# Altium schematic sheet PMP9755.SchDoc
size A4; Date: Not shown in title block; ApprovedBy: Not shown in title block; CheckedBy: Not shown in title block; Author: Not shown in title block; CompanyName: Not shown in title block; Engineer: Not shown in title block; Organization: Not shown in title block; Address1: Not shown in title block; Address2: Not shown in title block; Address3: Not shown in title block; Address4: Not shown in title block; DocumentNumber: 1; Revision: Use project parameter SCH_Rev; SheetNumber: 1; SheetTotal: 1; PageSetup: Record=PageOptions|CenterHorizontal=True|CenterVertical=True|PrintScale=0.91|XCorrection=1.00|YCorrection=1.00|PrintKind=0|BorderSize=5000000|LeftOffset=0|BottomOffset=0|Orientation=2|PaperLength=1000|PaperWidth=1000|Scale=100|PaperSource=15|PrintQuality=600|MediaType=1|DitherType=10|PaperKind=Letter|PrintScaleMode=1; CurrentTime: Not shown in title block; CurrentDate: Not shown in title block; Time: Not shown in title block; DocumentFullPathAndName: Not shown in title block; DocumentName: Not shown in title block; ModifiedDate: Not shown in title block; ImagePath: Not shown in title block
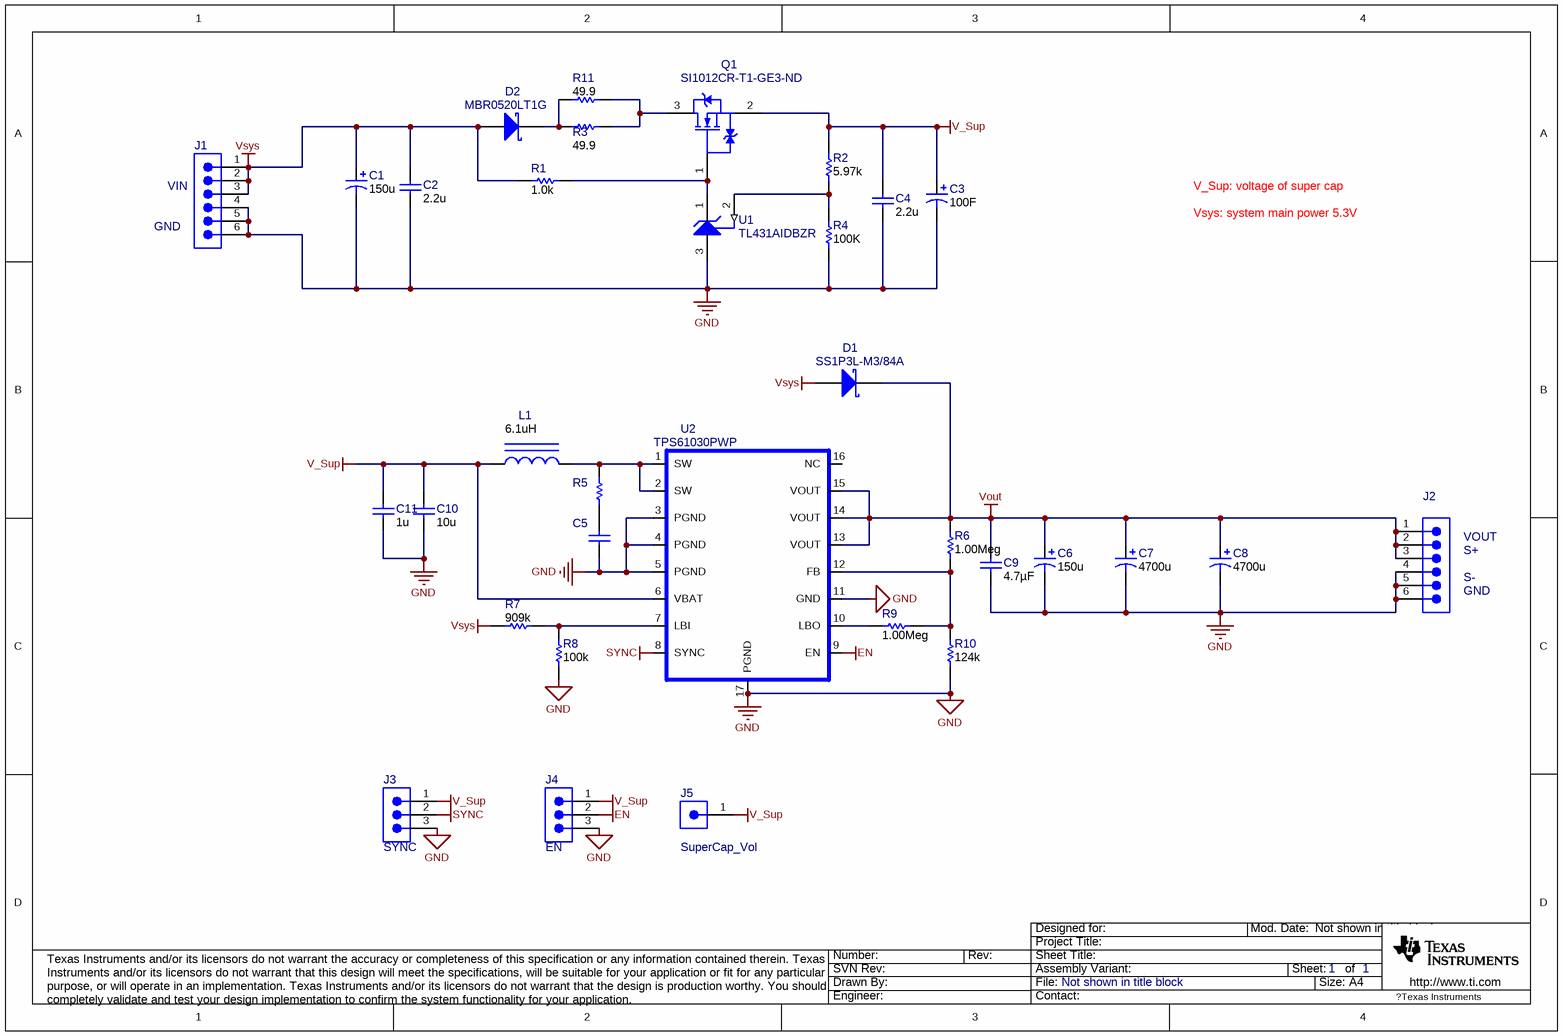
[diagram p0: PMP9755.SchDoc]

## Parts
C1  ValueDisplayed: 150u  [3528-21]  (hidden comment: T520B157M006ATE070)
C2  ValueDisplayed: 2.2u  [0603]  (hidden comment: GRM188R61A225KE34D)
C3  ValueDisplayed: 100F  [HV_2500x5000]  (hidden comment: HVZ0E107NF-LT)
C4  ValueDisplayed: 2.2u  [0603]  (hidden comment: GRM188R60J225KE19D)
C5  GRM1885C1H101JA01D  [0603]  (value not drawn)
C6  ValueDisplayed: 150u  [3528-21]  (hidden comment: T520B157M006ATE070)
C7  ValueDisplayed: 4700u  [FR_1250x2500]  (hidden comment: EEUFR0J472)
C8  ValueDisplayed: 4700u  [FR_1250x2500]  (hidden comment: EEUFR0J472)
C9  ValueDisplayed: 4.7µF  [0603]  (hidden comment: GRM188R61C475KAAJ)
C10  ValueDisplayed: 10u  [0603]  (hidden comment: GRM188R61A106ME69)
C11  ValueDisplayed: 1u  [0603]  (hidden comment: GRM185R60J105KE26D)
D1  SS1P3L-M3/84A  [DO-220AA]
D2  MBR0520LT1G  [SOD-123]
J1  TSW-106-07-G-S  [TSW-106-07-G-S]  (value not drawn)
J2  TSW-106-07-G-S  [TSW-106-07-G-S]  (value not drawn)
J3  TSW-103-07-G-S  [TSW-103-07-G-S]  (value not drawn)
J4  TSW-103-07-G-S  [TSW-103-07-G-S]  (value not drawn)
J5  TSW-101-17-T-S  [Samtec_TSW-101-17-T-S]  (value not drawn)
L1  value 6.1uH  [cdrh127]  (hidden comment: CDRH127NP-6R1NC)
Q1  SI1012CR-T1-GE3-ND  [SOT-416]
R1  value 1.0k  [0603]  (hidden comment: CRCW06031K00JNEA)
R2  value 5.97k  [0603]  (hidden comment: RT0603BRD075K97L)
R3  value 49.9  [2512]  (hidden comment: CRCW251249R9FKEG)
R4  value 100K  [0603]  (hidden comment: RT0603DRE07100KL)
R5  CRCW0603100RJNEA  [0603]  (value not drawn)
R6  value 1.00Meg  [0603]  (hidden comment: RC0603FR-071ML)
R7  value 909k  [0603]  (hidden comment: RC0603FR-07909KL)
R8  value 100k  [0603]  (hidden comment: RT0603DRE07100KL)
R9  value 1.00Meg  [0603]  (hidden comment: RC0603FR-071ML)
R10  value 124k  [0603]  (hidden comment: CRCW0603124KFKEA)
R11  value 49.9  [2512]  (hidden comment: CRCW251249R9FKEG)
U1  TL431AIDBZR  [DBZ0003A_N]
U2  TPS61030PWP  [PWP16]

## Nets
EN: J4.2 U2.9(EN)
GND: C1.2(-) C2.2 C3.2(-) C4.2 C5.2 C6.2(-) C7.2(-) C8.2(-) C9.2 C10.2 C11.2 J1.4 J1.5 J1.6 J2.4 J2.5 J2.6 J3.3 J4.3 R4.2 R8.1 R10.1 U1.3(ANODE) U2.3(PGND) U2.4(PGND) U2.5(PGND) U2.11(GND) U2.17(PGND)
SYNC: J3.2 U2.8(SYNC)
V_Sup: C3.1(+) C4.1 C10.1 C11.1 J3.1 J4.1 J5.1 L1.1 Q1.2(S) R2.2 U2.6(VBAT)
Vout: C6.1(+) C7.1(+) C8.1(+) C9.1 D1.1(K) J2.1 J2.2 J2.3 R6.2 U2.13(VOUT) U2.14(VOUT) U2.15(VOUT)
Vsys: C1.1(+) C2.1 D1.2(A) D2.2(A) J1.1 J1.2 J1.3 R1.1 R7.1
NetC5_1: C5.1 R5.1
NetD2_1: D2.1(K) R3.1 R11.1
NetL1_2: L1.2 R5.2 U2.1(SW) U2.2(SW)
NetQ1_1: Q1.1(G) R1.2 U1.1(CATHODE)
NetQ1_3: Q1.3(D) R3.2 R11.2
NetR2_1: R2.1 R4.1 U1.2(REF)
NetR6_1: R6.1 R9.1 R10.2 U2.12(FB)
NetR7_2: R7.2 R8.2 U2.7(LBI)
NetR9_2: R9.2 U2.10(LBO)

Not connected (* = marked no-connect by the designer): U2 16(NC)

## Notes on the sheet
- (near J1) GND
- (near J1) VIN
- V_Sup: voltage of super cap
- Vsys: system main power 5.3V
- (near J2) VOUT
- (near J2) S+
- (near J2) S-
- (near J2) GND
- (near J3) SYNC
- (near J4) EN
- (near J5) SuperCap_Vol
- Drawn By:
- SVN Rev:
- Number:
- Rev:
- Sheet Title:
- File:
- Project Title:
- Designed for:
- Assembly Variant:
- Mod. Date:
- Sheet:
- Size:
- of
- A4
- http://www.ti.com
- Texas Instruments and/or its licensors do not warrant the accuracy or completeness of this specification or any information contained therein. Texas Instruments and/or its licensors do not warrant that this design will meet the specifications, will be suitable for your application or fit for any particular purpose, or will operate in an implementation. Texas Instruments and/or its licensors do not warrant that the design is production worthy. You should completely validate and test your design implementation to confirm the system functionality for your application.
- Engineer:
- Contact:
- ?Texas Instruments

## Library data of the parts
C1 C6 = T520B157M006ATE070: CAP, TA, 150uF, 6.3V, +/-20%, 0.07 ohm, SMD; Manufacturer: Kemet; Polarized: Y; CompType: Capacitor; U/M: EA; Cap_F: 0.00015; Tolerance_%: 20; VDC_V: 6.3; ESR_Ohm: 0.07; IRMS_A: 1.3; TaMin_C: -55; TaMax_C: 105; Cap_Case: B; SymbolVersion: 2008-07-09; Value: 150uF; PartNumber: T520B157M006ATE070; PackageReference: 3528-21; RoHS: Y; Value1: 0.07 ohm; Value2: 6.3V; MountType: SMT; Technology: TA; Series: T520; Publisher: Texas Instruments; LatestRevisionDate: 2014-03-08; LatestRevisionNote: Updated supplier links; ComponentLink1Description: Datasheet link; ComponentLink1URL: http://www.kemet.com/kemet/web/homepage/kechome.nsf/file/T520%20Series/$file/KEM_T2015_T520.pdf; Supplier 1: Digi-Key; Supplier Part Number 1: 399-4732-1-ND; Supplier 2: Mouser; Supplier Part Number 2: 80-T520B157M6ATE70; Supplier 3: Newark; Supplier Part Number 3: 43K4377
C2 = GRM188R61A225KE34D: CAP, CERM, 2.2uF, 10V, +/-10%, X5R, 0603; Manufacturer: MuRata; Polarized: N; CompType: Capacitor; U/M: EA; Cap_F: 0.0000022; Tolerance_%: 10; Value1: Unknown; TaMin_C: -55; TaMax_C: 85; SymbolVersion: 2008-07-09; Value: 2.2uF; PartNumber: GRM188R61A225KE34D; PackageReference: 0603; RoHS: Y; VDC_V: 10; Value2: 10V; MountType: SMT; Technology: Ceramic; TempCo: X5R; Cap_Case: 0603; Published: 2008-06-19; Publisher: Texas Instruments; LatestRevisionDate: 2014-05-15; ComponentLink1Description: Datasheet link; ComponentLink1URL: http://search.murata.co.jp/Ceramy/PnsearchViewAction.do?HnOFG=ON&HnNFG=ON&SEL_CNT=50&sLang=en&sKey=GRM188R61A225KE34D&x=9&y=9&search=startwith; Supplier 1: Digi-Key; Supplier Part Number 1: 490-1545-1-ND; Supplier 2: Mouser; Supplier Part Number 2: 81-GRM188R61A225KE34; Supplier 3: Farnell; Supplier Part Number 3: 1828799
C3 = HVZ0E107NF-LT: CAP, Electric Double Layer, 100 F, 2.7 V, +30/-50%, 0.03 ohm, TH; Manufacturer: Kemet; Polarized: Y; CompType: Capacitor; Value: 100000000uF; U/M: EA; Cap_F: 100; Tolerance_%: 30; VDC_V: 2.7; Value2: 2.7V; ESR_ohm: 0.03; IRMS_A: 4; TaMin_C: -25; TaMax_C: 60; Cap_Case: 25x50; SymbolVersion: 2008-07-09; PartNumber: HVZ0E107NF-LT; PackageReference: 25x50mm; RoHS: Y; Value1: 0.03 ohm; MountType: TH; Technology: Electric Double Layer; Series: HV; Publisher: Texas Instruments; LatestRevisionDate: 2014-08-07; ComponentLink1Description: Datasheet link; ComponentLink1URL: http://capacitoredge.kemet.com/capedge2/DataSheet/Datasheet-HVZ0E107NF_LT.pdf?pn=HVZ0E107NF-LT{KEM}
C4 = GRM188R60J225KE19D: CAP, CERM, 2.2uF, 6.3V, +/-10%, X5R, 0603; Manufacturer: MuRata; Polarized: N; CompType: Capacitor; U/M: EA; Cap_F: 0.0000022; Tolerance_%: 10; Value1: Unknown; VDC_V: 6.3; TaMin_C: -55; TaMax_C: 85; SymbolVersion: 2008-07-09; Value: 2.2uF; PartNumber: GRM188R60J225KE19D; PackageReference: 0603; RoHS: Y; Value2: 6.3V; MountType: SMT; Technology: Ceramic; TempCo: X5R; Cap_Case: 0603; Published: 2008-06-19; Publisher: Texas Instruments; LatestRevisionDate: 2014-05-15; ComponentLink1Description: Datasheet link; ComponentLink1URL: http://search.murata.co.jp/Ceramy/PnsearchViewAction.do?HnOFG=ON&HnNFG=ON&SEL_CNT=50&sLang=en&sKey=GRM188R60J225KE19D&x=9&y=9&search=startwith; Supplier 1: Mouser; Supplier Part Number 1: 81-GRM18R60J225KE19D
C5 = GRM1885C1H101JA01D: CAP, CERM, 100pF, 50V, +/-5%, C0G/NP0, 0603; Manufacturer: MuRata; Polarized: N; CompType: Capacitor; U/M: EA; Cap_F: 0.0000000001; Tolerance_%: 5; Value1: Unknown; VDC_V: 50; TaMin_C: -55; TaMax_C: 125; SymbolVersion: 2008-07-09; Value: 100pF; PartNumber: GRM1885C1H101JA01D; ValueDisplayed: 100pF; PackageReference: 0603; RoHS: Y; Value2: 50V; MountType: SMT; Technology: Ceramic; TempCo: C0G/NP0; Cap_Case: 0603; Published: 2008-06-19; Publisher: Texas Instruments; LatestRevisionDate: 2014-05-15; ComponentLink1Description: Datasheet link; ComponentLink1URL: http://search.murata.co.jp/Ceramy/PnsearchViewAction.do?HnOFG=ON&HnNFG=ON&SEL_CNT=50&sLang=en&sKey=GRM1885C1H101JA01D&x=9&y=9&search=startwith; Supplier 1: Digi-Key; Supplier Part Number 1: 490-1427-1-ND; Supplier 2: Mouser; Supplier Part Number 2: 81-GRM39C101J50; Supplier 3: Farnell; Supplier Part Number 3: 8819866
C7 C8 = EEUFR0J472: CAP, AL, 4700uF, 6.3V, +/-20%, 0.015 ohm, TH; Manufacturer: Panasonic; Polarized: Y; CompType: Capacitor; U/M: EA; Cap_F: 0.0047; Tolerance_%: 20; VDC_V: 6.3; ESR_Ohm: 0.015; IRMS_A: 3.19; TaMin_C: -40; TaMax_C: 105; Cap_Case: 12.5x25; SymbolVersion: 2008-07-09; Value: 4700uF; PartNumber: EEUFR0J472; PackageReference: 12.5x25mm; RoHS: Y; Value1: 0.015 ohm; Value2: 6.3V; MountType: TH; Technology: AL; Series: FR; Publisher: Texas Instruments; LatestRevisionDate: 2014-05-19; ComponentLink1Description: Datasheet link; ComponentLink1URL: http://industrial.panasonic.com/www-data/pdf/ABA0000/ABA0000CE132.pdf; Supplier 1: Digi-Key; Supplier Part Number 1: P14368-ND; Supplier 2: Mouser; Supplier Part Number 2: 667-EEU-FR0J472; Supplier 3: Farnell; Supplier Part Number 3: 1800613
C9 = GRM188R61C475KAAJ: CAP, CERM, 4.7 µF, 16 V, +/- 10%, X5R, 0603; Manufacturer: MuRata; Polarized: N; CompType: Capacitor; Value: 4.7uF; U/M: EA; Cap_F: 0.0000047; Tolerance_%: 10; Value1: Unknown; VDC_V: 16; Value2: 16V; TaMin_C: -55; TaMax_C: 85; SymbolVersion: 2008-07-09; PartNumber: GRM188R61C475KAAJ; PackageReference: 0603; RoHS: Y; MountType: SMT; Technology: Ceramic; TempCo: X5R; Cap_Case: 0603; Published: 2008-06-19; Publisher: Texas Instruments; LatestRevisionDate: 2014-07-21; ComponentLink1Description: Datasheet link; ComponentLink1URL: http://psearch.murata.com/capacitor/product/GRM188R61C475KAAJ%23.pdf
C10 = GRM188R61A106ME69: CAP, CERM, 10uF, 10V, +/-20%, X5R, 0603; Manufacturer: MuRata; Polarized: N; CompType: Capacitor; U/M: EA; Cap_F: 0.00001; Tolerance_%: 20; Value1: Unknown; VDC_V: 10; TaMin_C: -55; TaMax_C: 85; SymbolVersion: 2008-07-09; Value: 10uF; PartNumber: GRM188R61A106ME69; PackageReference: 0603; RoHS: Y; Value2: 10V; MountType: SMT; Technology: Ceramic; TempCo: X5R; Cap_Case: 0603; Published: 2008-06-19; Publisher: Texas Instruments; LatestRevisionDate: 2014-05-15; ComponentLink1Description: Datasheet link; ComponentLink1URL: http://psearch.murata.com/capacitor/product/GRM188R61A106ME69%23.pdf
C11 = GRM185R60J105KE26D: CAP, CERM, 1uF, 6.3V, +/-10%, X5R, 0603; Manufacturer: MuRata; Polarized: N; CompType: Capacitor; U/M: EA; Cap_F: 0.000001; Tolerance_%: 10; Value1: Unknown; VDC_V: 6.3; TaMin_C: -55; TaMax_C: 85; SymbolVersion: 2008-07-09; Value: 1uF; PartNumber: GRM185R60J105KE26D; PackageReference: 0603; RoHS: Y; Value2: 6.3V; MountType: SMT; Technology: Ceramic; TempCo: X5R; Cap_Case: 0603; Published: 2008-06-19; Publisher: Texas Instruments; LatestRevisionDate: 2014-05-15; ComponentLink1Description: Datasheet link; ComponentLink1URL: http://search.murata.co.jp/Ceramy/PnsearchViewAction.do?HnOFG=ON&HnNFG=ON&SEL_CNT=50&sLang=en&sKey=GRM185R60J105KE26D&x=9&y=9&search=startwith; Supplier 1: Mouser; Supplier Part Number 1: 81-GRM185R60J105KE26
D1 = SS1P3L-M3/84A: Diode, Schottky, 30V, 1.5A, DO-220AA; Manufacturer: Vishay-Semiconductor; U/M: EA; Vf_V: 0.45; Value2: 0.45V; Io_A: 1.5; Vr_V: 30; TJmax_C: 150; RJC_CperW: 20; CompType: Diode; SymbolVersion: 2008-12-08; PartNumber: SS1P3L-M3/84A; PackageReference: DO-220AA; Value: 30V; Value1: 1.5A; MountType: SMT; Type: Schottky; RoHS: Y; Published: 2008-06-26; Publisher: Texas Instruments; LatestRevisionDate: 2014-04-09; ComponentLink1Description: Datasheet link; ComponentLink1URL: http://www.vishay.com/docs/88915/ss1p3l.pdf; Supplier 1: Digi-Key; Supplier Part Number 1: SS1P3L-M3/84AGICT-ND; Supplier 2: Mouser; Supplier Part Number 2: 625-SS1P3L-M3/84A; Supplier 3: Newark; Supplier Part Number 3: 79R2711
D2 = MBR0520LT1G: Diode, Schottky, 20V, 0.5A, SOD-123; Manufacturer: ON Semiconductor; U/M: EA; Vf_V: 0.385; Value2: 0.385V; Io_A: 0.5; Vr_V: 20; TJmax_C: 125; RJC_CperW: 150; CompType: Diode; SymbolVersion: 2008-12-08; PartNumber: MBR0520LT1G; PackageReference: SOD-123; Value: 20V; Value1: 0.5A; MountType: SMT; Type: Schottky; RoHS: Y; Published: 2008-06-26; Publisher: Texas Instruments; LatestRevisionDate: 2014-07-01; ComponentLink1Description: Datasheet link; ComponentLink1URL: http://www.onsemi.com/pub_link/Collateral/MBR0520LT1-D.PDF; Supplier 1: Digi-Key; Supplier Part Number 1: MBR0520LT1GOSCT-ND; Supplier 2: Mouser; Supplier Part Number 2: 863-MBR0520LT1G; Supplier 3: Farnell; Supplier Part Number 3: 9556915
J1 J2 = TSW-106-07-G-S: Header, TH, 100mil, 6x1, Gold plated, 230 mil above insulator; Manufacturer: Samtec, Inc.; Alternate Manufacturer: Any; Alternate PartNumber: Equivalent; U/M: EA; PartNumber: TSW-106-07-G-S; ClassName: Header; CompType: Header; RoHS: Y; PackageReference: TSW-106-07-G-S; MountType: TH; ComponentLink1Description: Datasheet Link; ComponentLink1URL: http://samtec.com/ftppub/pdf/TSW_TH.PDF; Publisher: Texas Instruments; LatestRevisionDate: 2012-11-04; LatestRevisionNote: Added parts, moved some to Hardware.IntLib; Supplier 1: Digi-Key; Supplier Part Number 1: SAM1029-06-ND
J3 J4 = TSW-103-07-G-S: Header, TH, 100mil, 3x1, Gold plated, 230 mil above insulator; Manufacturer: Samtec, Inc.; Alternate Manufacturer: Any; Alternate PartNumber: Equivalent; U/M: EA; PartNumber: TSW-103-07-G-S; ClassName: Header; CompType: Header; RoHS: Y; PackageReference: TSW-103-07-G-S; MountType: TH; ComponentLink1Description: Datasheet Link; ComponentLink1URL: http://samtec.com/ftppub/pdf/TSW_TH.PDF; Publisher: Texas Instruments; LatestRevisionDate: 2012-11-04; LatestRevisionNote: Added parts, moved some to Hardware.IntLib; Supplier 1: Digi-Key; Supplier Part Number 1: SAM1029-03-ND
J5 = TSW-101-17-T-S: CONN HEADER 1POS .100" SNGL TIN, TH; Manufacturer: Samtec; SymbolCreator: a0412235; U/M: EA; SymbolVersion: 2013-05-22; PartNumber: TSW-101-17-T-S; PackageReference: 2.54mm Header; CompType: Header; RoHS: Y; MountType: TH; ComponentLink1Description: Datasheet Link; ComponentLink1URL: http://www.samtec.com/documents/webfiles/cpdf/TSW-XXX-XX-XXX-X-XX-XXX-MKT.pdf; Publisher: Texas Instruments; LatestRevisionDate: 2014-04-21; Supplier 1: Digi-Key; Supplier Part Number 1: SAM1067-01-ND
L1 = CDRH127NP-6R1NC: Inductor, Shielded Drum Core, Ferrite, 6.1uH, 6.6A, 0.0176 ohm, SMD; Manufacturer: Sumida; Ind_H: 6.1E-6; ValueDisplayed: 6.1µH; Imax_A: 6.6; Irms: 6.6A @ 40C rise; Isat: 6.6A @ 25% inductance drop; DCR_ohm: 0.0176; U/M: EA; SymbolVersion: 2008-07-23; CompType: Inductor; PartNumber: CDRH127NP-6R1NC; Value1: 0.0176 ohm; Value2: 6.6A; Technology: Shielded Drum Core; MountType: SMT; Material: Ferrite; PackageReference: CDRH127; Published: 2008-06-26; Publisher: Texas Instruments; LatestRevisionDate: 2014-03-26; ComponentLink1Description: Datasheet link; ComponentLink1URL: http://www.sumida.com/products/pdf/CDRH127,127LD.pdf; RoHS: Y; Supplier 1: Digi-Key; Supplier Part Number 1: 308-1476-1-ND; Supplier 2: Mouser; Supplier Part Number 2: 851-CDRH127NP-6R1NC
Q1 = SI1012CR-T1-GE3-ND: MOSFET, N/P-CH, 20V, 0.63A, SOT-416; Manufacturer: Vishay-Siliconix; Alternate Manufacturer: None; SymbolCreator: a0411947; U/M: EA; ChType: N; VdsMax_V: 20; Value1: 0.396 ohm; Rdson45_Ohm: 0.396; Value2: 2 nC; QgTyp_nC: 2; Vgs_V: 8; IdsMax_A: 0.63; SymbolVersion: 2014-07-21; PartNumber: SI1012CR-T1-GE3-ND; PackageReference: SOT-416; CompType: MOSFET; Value: 20V; RoHS: Y; MountType: SMT; Published: 2008-06-19; Publisher: Texas Instruments; LatestRevisionDate: 2014-07-21; LatestRevisionNote: Added parts.; ComponentLink1Description: Datasheet link; ComponentLink1URL: http://www.vishay.com/docs/67519/si1012cr.pdf; Supplier 1: Digi-Key; Supplier Part Number 1: SI1012CR-T1-GE3-ND; Supplier 2: Mouser; Supplier Part Number 2: 78-SI1012CR-T1-GE3; Supplier 3: Farnell; Supplier Part Number 3: 2056674
R1 = CRCW06031K00JNEA: RES, 1.0k ohm, 5%, 0.1W, 0603; Manufacturer: Vishay-Dale; CompType: Resistor; Res_ohm: 1000; Value_Code: 1k00; Tolerance_%: 5; Power_W: 0.1; VDC_V: 75; TempCo: 200 ppm/C; EIA_Code: E24; U/M: EA; SymbolVersion: 2009-05-29; PartNumber: CRCW06031K00JNEA; PackageReference: 0603; RoHS: Y; Value1: 5%; Value2: 0.1W; MountType: SMT; Technology: Thick Film; Published: 2008-06-26; Publisher: Texas Instruments; LatestRevisionDate: 2014-05-20; ComponentLink1Description: Datasheet link; ComponentLink1URL: http://www.vishay.com/docs/20035/dcrcwe3.pdf; Supplier 1: Mouser; Supplier Part Number 1: 71-CRCW0603J-1.0K-E3; Supplier 2: Farnell; Supplier Part Number 2: 1652851; Supplier 3: Newark; Supplier Part Number 3: 59M6750
R2 = RT0603BRD075K97L: RES, 5.97k ohm, 0.1%, 0.1W, 0603; Manufacturer: Yageo America; CompType: Resistor; Res_ohm: 5970; Value_Code: 5k97; Tolerance_%: 0.1; VDC_V: 75; TempCo: 25 ppm/C; EIA_Code: E192; U/M: EA; SymbolVersion: 2009-05-29; PartNumber: RT0603BRD075K97L; PackageReference: 0603; RoHS: Y; Value1: 0.1%; Power_W: 0.1; Value2: 0.1W; MountType: SMT; Technology: Thin Film; Published: 2008-06-26; Publisher: Texas Instruments; LatestRevisionDate: 2014-05-20; ComponentLink1Description: Datasheet link; ComponentLink1URL: http://www.yageo.com/pdf/PYu-RT_1-to-0.05_RoHS_L_3.pdf
R3 R11 = CRCW251249R9FKEG: RES, 49.9 ohm, 1%, 1W, 2512; Manufacturer: Vishay-Dale; CompType: Resistor; Value_Code: 49R9; Tolerance_%: 1; VDC_V: 500; TempCo: 100 ppm/C; EIA_Code: E96; U/M: EA; SymbolVersion: 2009-05-29; PartNumber: CRCW251249R9FKEG; PackageReference: 2512; RoHS: Y; Res_ohm: 49.9; Value1: 1%; Power_W: 1; Value2: 1W; MountType: SMT; Technology: Thick Film; Published: 2008-06-26; Publisher: Texas Instruments; LatestRevisionDate: 2014-06-29; ComponentLink1Description: Datasheet link; ComponentLink1URL: http://www.vishay.com/doc?20035; Supplier 1: Digi-Key; Supplier Part Number 1: 541-49.9AFCT-ND
R4 R8 = RT0603DRE07100KL: RES, 100k ohm, 0.5%, 0.1W, 0603; Manufacturer: Yageo America; CompType: Resistor; Res_ohm: 100000; Tolerance_%: 0.5; Power_W: 0.1; VDC_V: 75; TempCo: 50 ppm/C; EIA_Code: E192; U/M: EA; SymbolVersion: 2009-05-29; PartNumber: RT0603DRE07100KL; PackageReference: 0603; RoHS: Y; Value_Code: 100k; Value1: 0.5%; Value2: 0.1W; MountType: SMT; Technology: Thin Film; Published: 2008-06-26; Publisher: Texas Instruments; LatestRevisionDate: 2014-04-18; ComponentLink1Description: Datasheet link; ComponentLink1URL: http://www.yageo.com/pdf/PYu-RT_1-to-0.05_RoHS_L_3.pdf
R5 = CRCW0603100RJNEA: RES, 100 ohm, 5%, 0.1W, 0603; Manufacturer: Vishay-Dale; CompType: Resistor; Value: 100; Value_Code: 100R; Tolerance_%: 5; Power_W: 0.1; VDC_V: 75; TempCo: 200 ppm/C; EIA_Code: E24; U/M: EA; SymbolVersion: 2009-05-29; PartNumber: CRCW0603100RJNEA; PackageReference: 0603; RoHS: Y; Res_ohm: 100; Value1: 5%; Value2: 0.1W; MountType: SMT; Technology: Thick Film; Published: 2008-06-26; Publisher: Texas Instruments; LatestRevisionDate: 2014-04-18; ComponentLink1Description: Datasheet link; ComponentLink1URL: http://www.vishay.com/docs/20035/dcrcwe3.pdf; Supplier 1: Digi-Key; Supplier Part Number 1: 541-100GCT-ND; Supplier 2: Mouser; Supplier Part Number 2: 71-CRCW0603J-100-E3; Supplier 3: Farnell; Supplier Part Number 3: 1514715
R6 R9 = RC0603FR-071ML: RES, 1.00Meg ohm, 1%, 0.1W, 0603; Manufacturer: Yageo America; CompType: Resistor; Res_ohm: 1000000; Value_Code: 1M00; Tolerance_%: 1; Power_W: 0.1; VDC_V: 150; TempCo: 200 ppm/C; EIA_Code: E96; U/M: EA; SymbolVersion: 2009-05-29; PartNumber: RC0603FR-071ML; PackageReference: 0603; RoHS: Y; Value1: 1%; Value2: 0.1W; MountType: SMT; Technology: Thick Film; Published: 2008-06-26; Publisher: Texas Instruments; LatestRevisionDate: 2014-04-18; ComponentLink1Description: Datasheet link; ComponentLink1URL: http://www.yageo.com/pdf/Pu-RC0603_51_PbFree_L_2.pdf; Supplier 1: Digi-Key; Supplier Part Number 1: 311-1.00MHRCT-ND; Supplier 2: Mouser; Supplier Part Number 2: 603-RC0603FR-071ML; Supplier 3: Farnell; Supplier Part Number 3: 9238840
R7 = RC0603FR-07909KL: RES, 909k ohm, 1%, 0.1W, 0603; Manufacturer: Yageo America; CompType: Resistor; Res_ohm: 909000; Tolerance_%: 1; Power_W: 0.1; VDC_V: 150; TempCo: 200 ppm/C; EIA_Code: E96; U/M: EA; SymbolVersion: 2009-05-29; PartNumber: RC0603FR-07909KL; PackageReference: 0603; RoHS: Y; Value_Code: 909k; Value1: 1%; Value2: 0.1W; MountType: SMT; Technology: Thick Film; Published: 2008-06-26; Publisher: Texas Instruments; LatestRevisionDate: 2014-04-18; ComponentLink1Description: Datasheet link; ComponentLink1URL: http://www.yageo.com/pdf/Pu-RC0603_51_PbFree_L_2.pdf; Supplier 1: Digi-Key; Supplier Part Number 1: 311-909KHRCT-ND; Supplier 2: Mouser; Supplier Part Number 2: 603-RC0603FR-07909KL
R10 = CRCW0603124KFKEA: RES, 124k ohm, 1%, 0.1W, 0603; Manufacturer: Vishay-Dale; CompType: Resistor; Res_ohm: 124000; Tolerance_%: 1; Power_W: 0.1; VDC_V: 75; TempCo: 100 ppm/C; EIA_Code: E96; U/M: EA; SymbolVersion: 2009-05-29; PartNumber: CRCW0603124KFKEA; PackageReference: 0603; RoHS: Y; Value_Code: 124k; Value1: 1%; Value2: 0.1W; MountType: SMT; Technology: Thick Film; Published: 2008-06-26; Publisher: Texas Instruments; LatestRevisionDate: 2014-04-18; ComponentLink1Description: Datasheet link; ComponentLink1URL: http://www.vishay.com/docs/20035/dcrcwe3.pdf; Supplier 1: Digi-Key; Supplier Part Number 1: 541-124KHCT-ND; Supplier 2: Mouser; Supplier Part Number 2: 71-CRCW0603-124K-E3; Supplier 3: Farnell; Supplier Part Number 3: 1151676
U1 = TL431AIDBZR: Adjustable Precision Shunt Regulator, 34 ppm / degC, 100 mA, -40 to 85 degC, 3-pin SOT-23 (DBZ), Green (RoHS & no Sb/Br); Manufacturer: Texas Instruments; Alternate Manufacturer: None; Alternate PartNumber: Equivalent; Initial Accuracy @ 25/deg C(%): 1; Iout/Iz(Max)(mA): 100; Min Iz for Regulation(uA): 600; Rating: Catalog; SubFamily: Shunt Voltage Reference; Temp Coeff(Max)(ppm/ degree C): 92; Temp Coeff(Typ)(ppm/ degree C): 34; VO Adj(Max)(V): 36; VO Adj(Min)(V): 2.495; DatasheetVersion: SLVS543M; PackageVersion: 4203227/B; PackageReference: DBZ0003A; PackageDescription: 3-Pin Plastic Small Outline, Body 2.92 x 1.3 mm, Pitch 0.95 mm; Supplier 1: Digi-Key; Supplier Part Number 1: 296-17329-2-ND; Supplier 2: Digi-Key; Supplier Part Number 2: 296-17329-1-ND; Supplier 3: Digi-Key; Supplier Part Number 3: 296-17329-6-ND; Supplier 4: Farnell; Supplier Part Number 4: 1411108; Supplier 5: Newark; Supplier Part Number 5: 44J2371; Supplier 6: Mouser; Supplier Part Number 6: 595-TL431AIDBZR; Eco-Plan: Green (RoHS & no Sb/Br); MountType: SMT; Code_JEDEC: TO-236; PartNumber: TL431AIDBZR; ComponentLink1Description: Manufacturer URL; ComponentLink1URL: http://www.ti.com/; ComponentLink2Description: Datasheet; ComponentLink2URL: http://www.ti.com/general/docs/lit/getliterature.tsp?genericPartNumber=TL431A&fileType=pdf; ComponentLink3Description: Package Specification; ComponentLink3URL: http://www.ti.com/litv/pdf/mpds108a
U2 = TPS61030PWP: IC, Li ION, Boost converter, Adj V.; Manufacturer: Texas Instruments; Alternate Manufacturer: None; Area: 83200; SymbolVersion: 10/17/2008 12:56:48; PackageReference: PWP16; ComponentHeight: 0.050; PartNumber: TPS61030PWP; Value: TPS61030PWP; ComponentLink1Description: AEO Datasheet Link